# Altium schematic sheet 013_BP.SchDoc
size A4; SheetNumber: 1; SheetTotal: 1
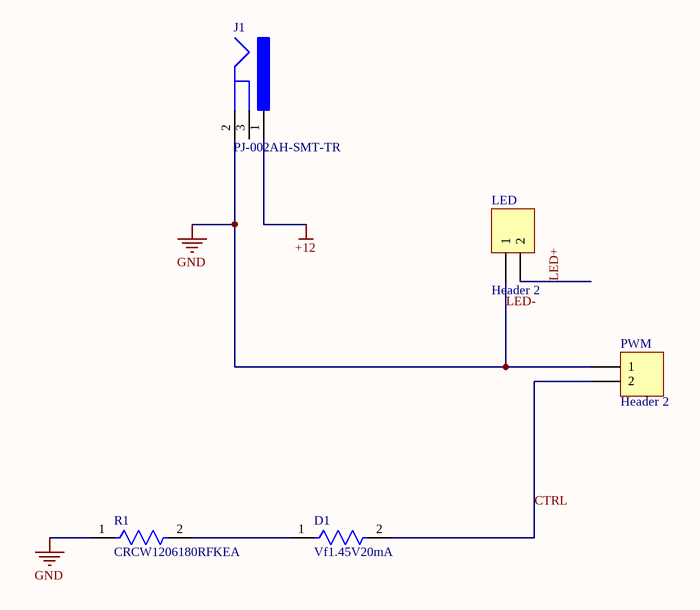
[diagram p0: 013_BP.SchDoc]

## Parts
D1  Vf1.45V20mA  [FP-CRCW1206-e3-IPC_C]
J1  PJ-002AH-SMT-TR  [CUI-PJ-002AH-4_V]
LED  Header 2  [HDR1X2]
PWM  Header 2  [HDR1X2]
R1  CRCW1206180RFKEA  [FP-CRCW1206-e3-IPC_C]

## Nets
+12: J1.1
LED-: J1.2 LED.1 PWM.1 R1.1  [also labelled GND]
CTRL: D1.2 PWM.2
LED+: LED.2
NetD1_1: D1.1 R1.2

Not connected (* = marked no-connect by the designer): J1 3

## Library data of the parts
D1 R1 = CMP-2003-01848-2: RES Thick Film, 180Ω, 1%, 0.25W, 100ppm/°C, 1206; Voltage Rating (DC): 200V; Resistance: 180R; Power Rating: 250mW; Depth: 1.6mm; Radiation Hardening: No; Contact Plating: Tin; Military Standard: Not; Height: 0.55mm; Packaging: Tape and Reel; Width: 1.6mm; Termination: SMD/SMT; Temperature Coefficient: 100ppm/°C; Package Quantity: 5000; Number of Pins: 2; Length: 3.2mm; Weight: 0.000353oz; Voltage Rating: 200V; Case Code (Imperial): 1206; Mount: Surface Mount; Max Operating Temperature: 155°C; Case/Package: 1206; Composition: Thick Film; Lead Free: Lead Free; Case Code (Metric): 3216; Tolerance: 1%; Min Operating Temperature: -55°C
J1 = CMP-2000-06896-2: DC Power Jack, Right Angle, -25 to 85 degC, 4-Pin 14.8 x 9 x 11 mm SMD, RoHS, Tape and Reel; Manufacturer: CUIInc.; Brand: CUI; Inside Contact Diameter: 2mm; Voltage Rating: 24V; Insulation Resistance: 100MOhms; Outside Contact Diameter: 6.5mm; Current Rating: 5A; Mounting Angle: Right; Contact Plating: Nickel; Package Description: 4-Pin Surface Mount Device, Body 14.8 x 9 mm, Pitch 6.1 mm; Factory Pack Quantity: 350; Datasheet Version: Rev. 1.03, 11/2012; Operating Temperature Range: -25Cto+85C; Termination Style: SMD/SMT; Product: Jacks; Contact Gender: Male; Product Category: DCPowerConnectors; RoHS: True; Connector Type: DCPowerJack; Packaging: Reel; Contact Material: Brass; Flammability Rating: UL94V-0; Datasheet URL: http://www.cui.com/product/resource/pj-002ah-smt.pdf; Package Reference: PJ-002AH; Manufacturer URL: http://www.cui.com/; PartNumber: PJ-002AH; Mounting Style: SMD/SMT; Mounting Technology: SurfaceMount; Housing Material: Polyamide(PA)
LED PWM = Header 2: Header, 2-Pin; LatestRevisionDate: 17-Jul-2002; LatestRevisionNote: Re-released for DXP Platform.; Publisher: Altium Limited